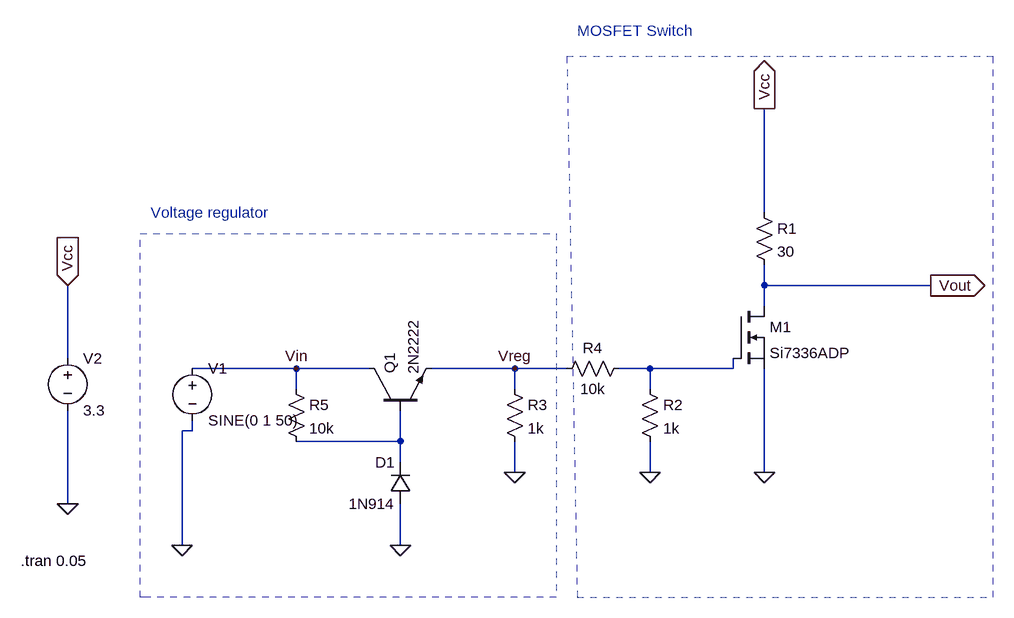
[diagram p0: schematic regulator.asc]
regulator.asc, the LTspice schematic file:
Version 4
SHEET 1 880 680
WIRE 256 -16 256 -176
WIRE 256 96 256 64
WIRE 512 96 256 96
WIRE 256 128 256 96
WIRE -816 208 -816 96
WIRE -464 224 -624 224
WIRE -352 224 -464 224
WIRE -128 224 -256 224
WIRE -48 224 -128 224
WIRE 80 224 32 224
WIRE 208 224 208 208
WIRE 208 224 80 224
WIRE -464 256 -464 224
WIRE -128 256 -128 224
WIRE 80 256 80 224
WIRE -624 320 -624 304
WIRE -624 320 -640 320
WIRE -304 336 -304 288
WIRE -304 336 -464 336
WIRE -304 368 -304 336
WIRE -128 384 -128 336
WIRE 80 384 80 336
WIRE 256 384 256 224
WIRE -816 432 -816 288
WIRE -640 496 -640 320
WIRE -304 496 -304 432
FLAG 256 384 0
FLAG 80 384 0
FLAG -128 384 0
FLAG -304 496 0
FLAG -640 496 0
FLAG -816 432 0
FLAG -816 96 Vcc
IOPIN -816 96 In
FLAG 256 -176 Vcc
IOPIN 256 -176 Out
FLAG 512 96 Vout
IOPIN 512 96 Out
FLAG -464 224 Vin
FLAG -128 224 Vreg
SYMBOL nmos 208 128 R0
SYMATTR InstName M1
SYMATTR Value Si7336ADP
SYMBOL res 240 -32 R0
SYMATTR InstName R1
SYMATTR Value 30
SYMBOL res 64 240 R0
SYMATTR InstName R2
SYMATTR Value 1k
SYMBOL res -144 240 R0
SYMATTR InstName R3
SYMATTR Value 1k
SYMBOL res 48 208 R90
WINDOW 0 0 56 VBottom 2
WINDOW 3 32 56 VTop 2
SYMATTR InstName R4
SYMATTR Value 10k
SYMBOL npn -352 288 R270
SYMATTR InstName Q1
SYMATTR Value 2N2222
SYMBOL res -480 240 R0
SYMATTR InstName R5
SYMATTR Value 10k
SYMBOL voltage -624 208 R0
WINDOW 123 24 124 Left 2
WINDOW 39 0 0 Left 0
SYMATTR InstName V1
SYMATTR Value SINE(0 1 50)
SYMBOL diode -288 432 R180
WINDOW 0 24 64 Left 2
WINDOW 3 24 0 Left 2
SYMATTR InstName D1
SYMATTR Value 1N914
SYMATTR Description Zener Diode
SYMATTR Type zener
SYMBOL voltage -816 192 R0
WINDOW 123 0 0 Left 0
WINDOW 39 0 0 Left 0
SYMATTR InstName V2
SYMATTR Value 3.3
TEXT -888 520 Left 2 !.tran 0.05
TEXT -688 -16 Left 2 ;Voltage regulator
TEXT -32 -296 Left 2 ;MOSFET Switch
LINE Normal -64 576 -688 576 2
LINE Normal -64 16 -64 576 2
LINE Normal -704 16 -64 16 2
LINE Normal -704 576 -704 16 2
LINE Normal -688 576 -704 576 2
LINE Normal -48 -256 -32 576 2
LINE Normal 608 -256 -48 -256 2
LINE Normal 608 576 608 -256 2
LINE Normal -32 576 608 576 2

The netlist it stands for:
* regulator.asc
M1 Vout N001 0 0 Si7336ADP
R1 Vcc Vout 30
R2 N001 0 1k
R3 Vreg 0 1k
R4 N001 Vreg 10k
Q1 Vin N002 Vreg 0 2N2222
R5 Vin N002 10k
V1 Vin 0 SINE(0 1 50)
D1 0 N002 1N914
V2 Vcc 0 3.3
.model D D
.lib standard.dio
.model NPN NPN
.model PNP PNP
.lib standard.bjt
.model NMOS NMOS
.model PMOS PMOS
.lib standard.mos
.tran 0.05
* Voltage regulator
* MOSFET Switch
.backanno
.end